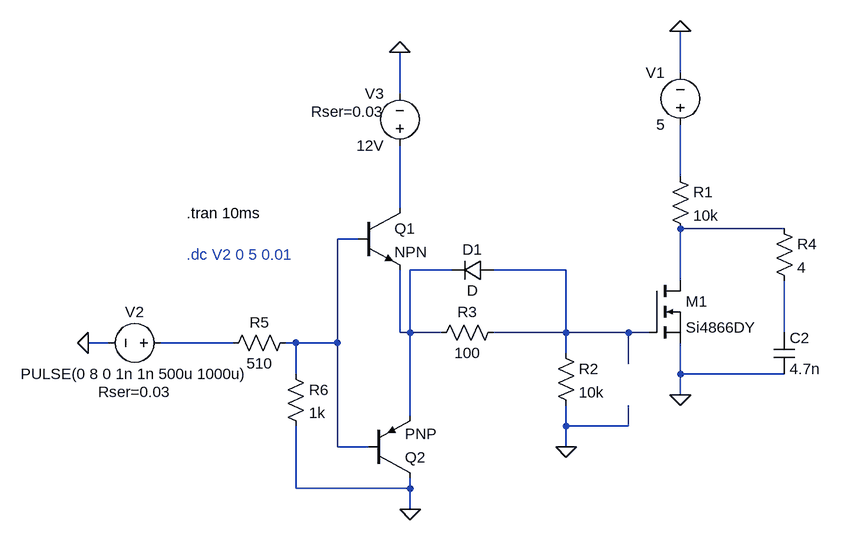
[diagram p0: schematic Draft3.asc]
Draft3.asc, the LTspice schematic file:
Version 4.1
SHEET 1 880 680
WIRE 176 -240 176 -304
WIRE -256 -208 -256 -272
WIRE 176 -80 176 -160
WIRE -256 -32 -256 -128
WIRE 336 0 176 0
WIRE -320 16 -352 16
WIRE -176 64 -240 64
WIRE 0 64 -112 64
WIRE 176 80 176 0
WIRE -256 160 -256 64
WIRE -240 160 -240 64
WIRE -240 160 -256 160
WIRE -192 160 -240 160
WIRE 0 160 0 64
WIRE 0 160 -112 160
WIRE 96 160 0 160
WIRE 128 160 96 160
WIRE 336 160 336 80
WIRE -704 176 -736 176
WIRE -512 176 -624 176
WIRE -416 176 -432 176
WIRE -352 176 -352 16
WIRE -352 176 -416 176
WIRE 0 192 0 160
WIRE 96 208 96 160
WIRE -416 224 -416 176
WIRE 176 224 176 176
WIRE 336 224 176 224
WIRE 176 256 176 224
WIRE -240 288 -240 160
WIRE 0 304 0 272
WIRE 96 304 96 272
WIRE 96 304 0 304
WIRE -352 336 -352 176
WIRE -304 336 -352 336
WIRE 0 336 0 304
WIRE -416 400 -416 304
WIRE -240 400 -240 384
WIRE -240 400 -416 400
WIRE -240 432 -240 400
FLAG 176 256 0
FLAG 176 -304 0
FLAG 0 336 0
FLAG -736 176 0
FLAG -240 432 0
FLAG -256 -272 0
SYMBOL nmos 128 80 R0
SYMATTR InstName M1
SYMATTR Value Si4866DY
SYMBOL res 160 -96 R0
SYMATTR InstName R1
SYMATTR Value 10k
SYMBOL voltage 176 -144 R180
WINDOW 0 24 96 Left 2
WINDOW 3 24 16 Left 2
WINDOW 123 0 0 Left 0
WINDOW 39 0 0 Left 0
SYMATTR InstName V1
SYMATTR Value 5
SYMBOL res -16 176 R0
SYMATTR InstName R2
SYMATTR Value 10k
SYMBOL voltage -608 176 R90
WINDOW 0 -32 56 VBottom 2
WINDOW 3 32 56 VTop 2
WINDOW 123 0 0 Left 0
WINDOW 39 60 56 VTop 2
SYMATTR InstName V2
SYMATTR Value PULSE(0 8 0 1n 1n 500u 1000u)
SYMATTR SpiceLine Rser=0.03
SYMBOL res -96 144 R90
WINDOW 0 0 56 VBottom 2
WINDOW 3 32 56 VTop 2
SYMATTR InstName R3
SYMATTR Value 100
SYMBOL res 320 -16 R0
SYMATTR InstName R4
SYMATTR Value 4
SYMBOL cap 320 160 R0
SYMATTR InstName C2
SYMATTR Value 4.7n
SYMBOL npn -320 -32 R0
SYMATTR InstName Q1
SYMBOL pnp -304 384 M180
SYMATTR InstName Q2
SYMBOL voltage -256 -112 R180
WINDOW 0 24 96 Left 2
WINDOW 3 24 16 Left 2
WINDOW 123 0 0 Left 0
WINDOW 39 24 68 Left 2
SYMATTR InstName V3
SYMATTR Value 12V
SYMATTR SpiceLine Rser=0.03
SYMBOL res -416 160 R90
WINDOW 0 0 56 VBottom 2
WINDOW 3 32 56 VTop 2
SYMATTR InstName R5
SYMATTR Value 510
SYMBOL diode -112 48 R90
WINDOW 0 0 32 VBottom 2
WINDOW 3 32 32 VTop 2
SYMATTR InstName D1
SYMBOL res -432 208 R0
SYMATTR InstName R6
SYMATTR Value 1k
TEXT -584 40 Left 2 ;.dc V2 0 5 0.01
TEXT -584 -24 Left 2 !.tran 10ms

The netlist it stands for:
* Draft3.asc
M1 N003 N006 0 0 Si4866DY
R1 N001 N003 10k
V1 N001 0 5
R2 N006 0 10k
V2 N008 0 PULSE(0 8 0 1n 1n 500u 1000u) Rser=0.03
R3 N006 N005 100
R4 N003 N007 4
C2 N007 0 4.7n
Q1 N002 N004 N005 0 NPN
Q2 0 N004 N005 0 PNP
V3 N002 0 12V Rser=0.03
R5 N004 N008 510
D1 N006 N005 D
R6 N004 0 1k
.model D D
.lib standard.dio
.model NPN NPN
.model PNP PNP
.lib standard.bjt
.model NMOS NMOS
.model PMOS PMOS
.lib standard.mos
* .dc V2 0 5 0.01
.tran 10ms
.backanno
.end